# EAGLE schematic Proxmark3_dev (EAGLE 5.11)

## Sheet 1 of 4
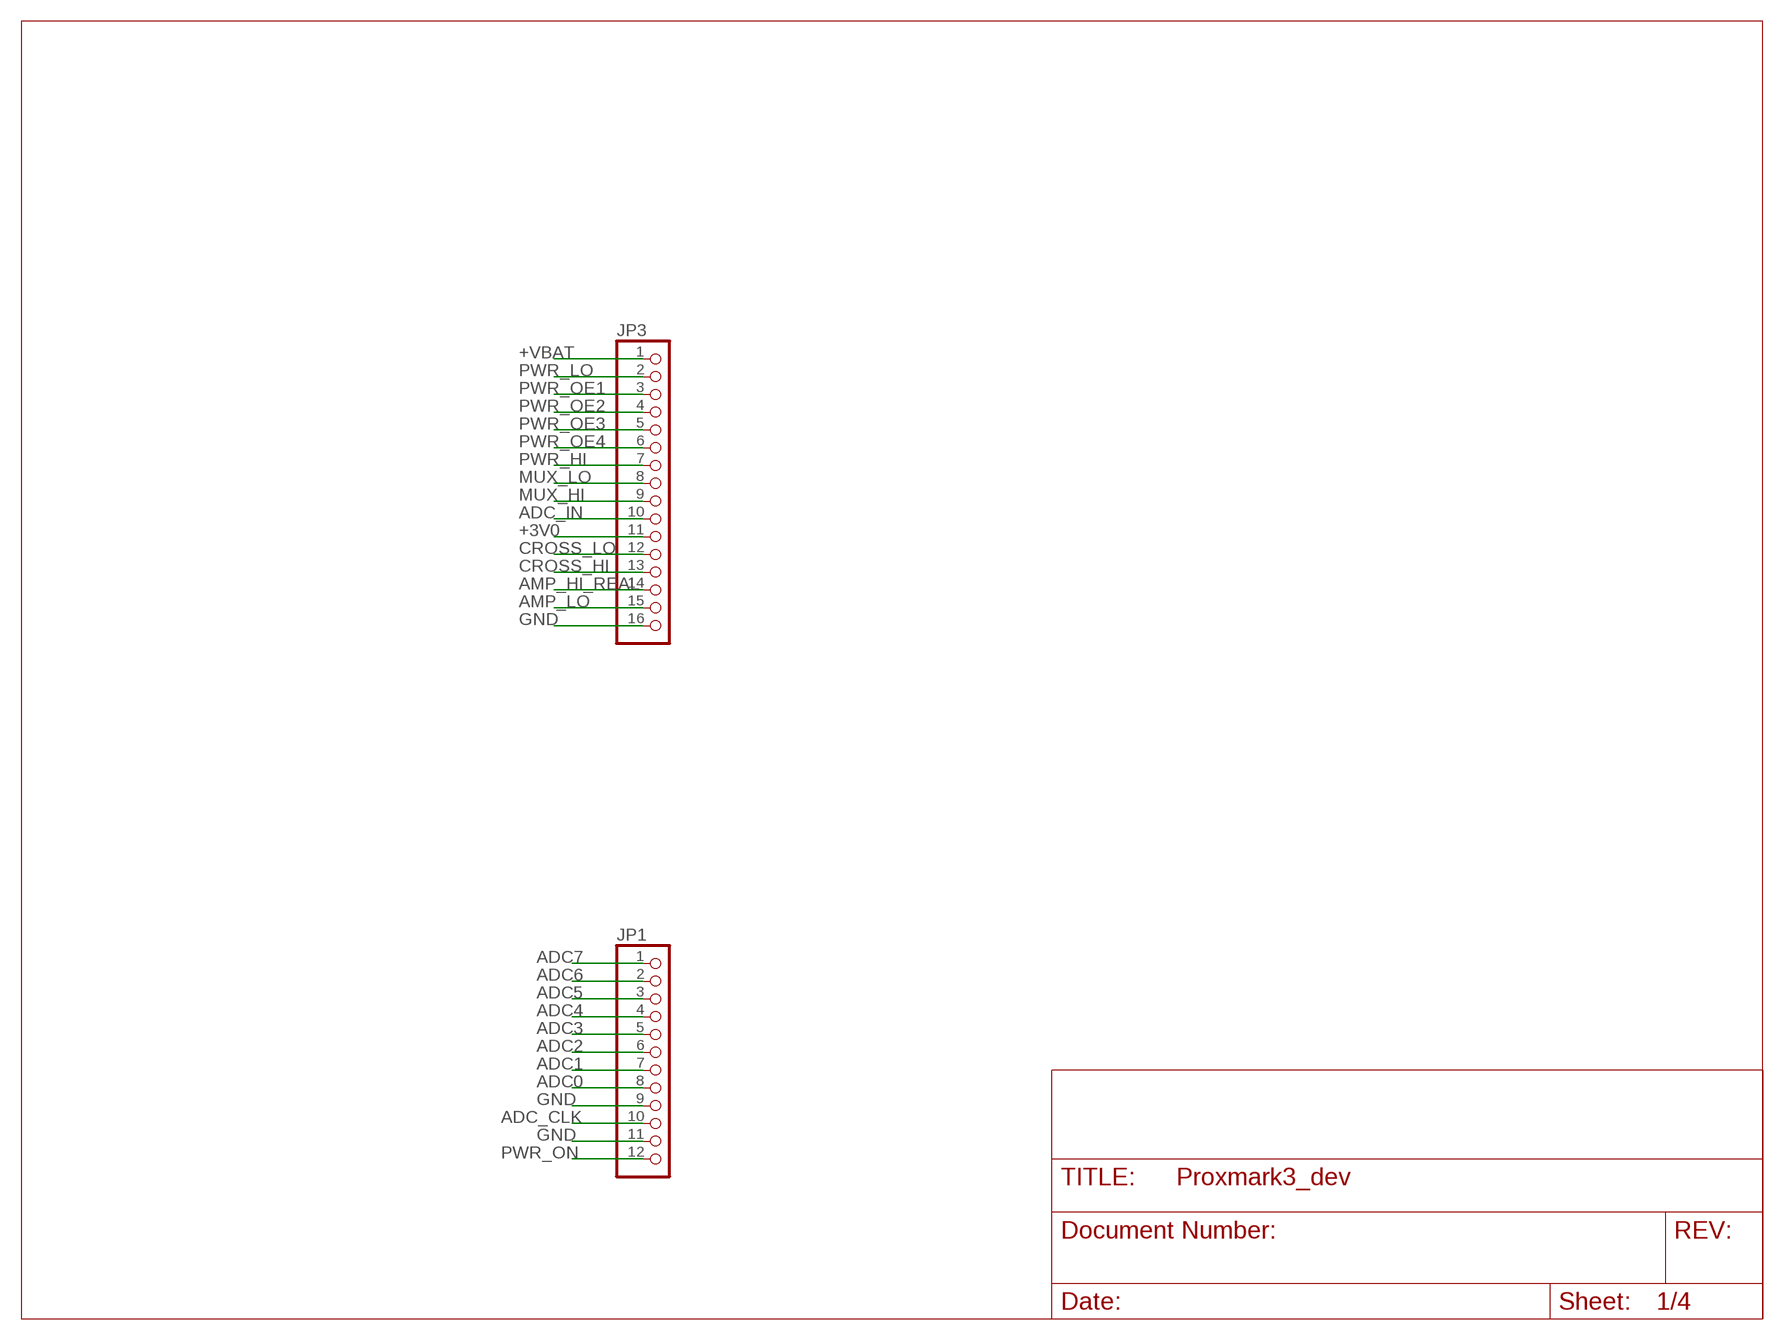
[diagram p0: schematic, sheet 1]

### Parts
JP1  PINHD-1X12  [1X12]
JP3  HEADER-1X16ROUND  [1X16_ROUND]

### Nets
+3V0: JP3.11 ; also sheet 2,3
+VBAT [power]: JP3.1 ; also sheet 2,4
ADC0: JP1.8 ; also sheet 2
ADC1: JP1.7 ; also sheet 2
ADC2: JP1.6 ; also sheet 2
ADC3: JP1.5 ; also sheet 2
ADC4: JP1.4 ; also sheet 2
ADC5: JP1.3 ; also sheet 2
ADC6: JP1.2 ; also sheet 2
ADC7: JP1.1 ; also sheet 2
ADC_CLK: JP1.10 ; also sheet 2
ADC_IN: JP3.10 ; also sheet 2,3
AMP_HI_REAL: JP3.14 ; also sheet 3
AMP_LO: JP3.15 ; also sheet 3
CROSS_HI: JP3.13 ; also sheet 2,3
CROSS_LO: JP3.12 ; also sheet 2,3
GND: JP1.9 JP1.11 JP3.16 ; also sheet 2,3,4
MUX_HI: JP3.9 ; also sheet 2,3
MUX_LO: JP3.8 ; also sheet 2,3
PWR_HI: JP3.7 ; also sheet 2,4
PWR_LO: JP3.2 ; also sheet 2,4
PWR_OE1: JP3.3 ; also sheet 2,4
PWR_OE2: JP3.4 ; also sheet 2,4
PWR_OE3: JP3.5 ; also sheet 2,4
PWR_OE4: JP3.6 ; also sheet 2,4
PWR_ON: JP1.12 ; also sheet 2

## Sheet 2 of 4
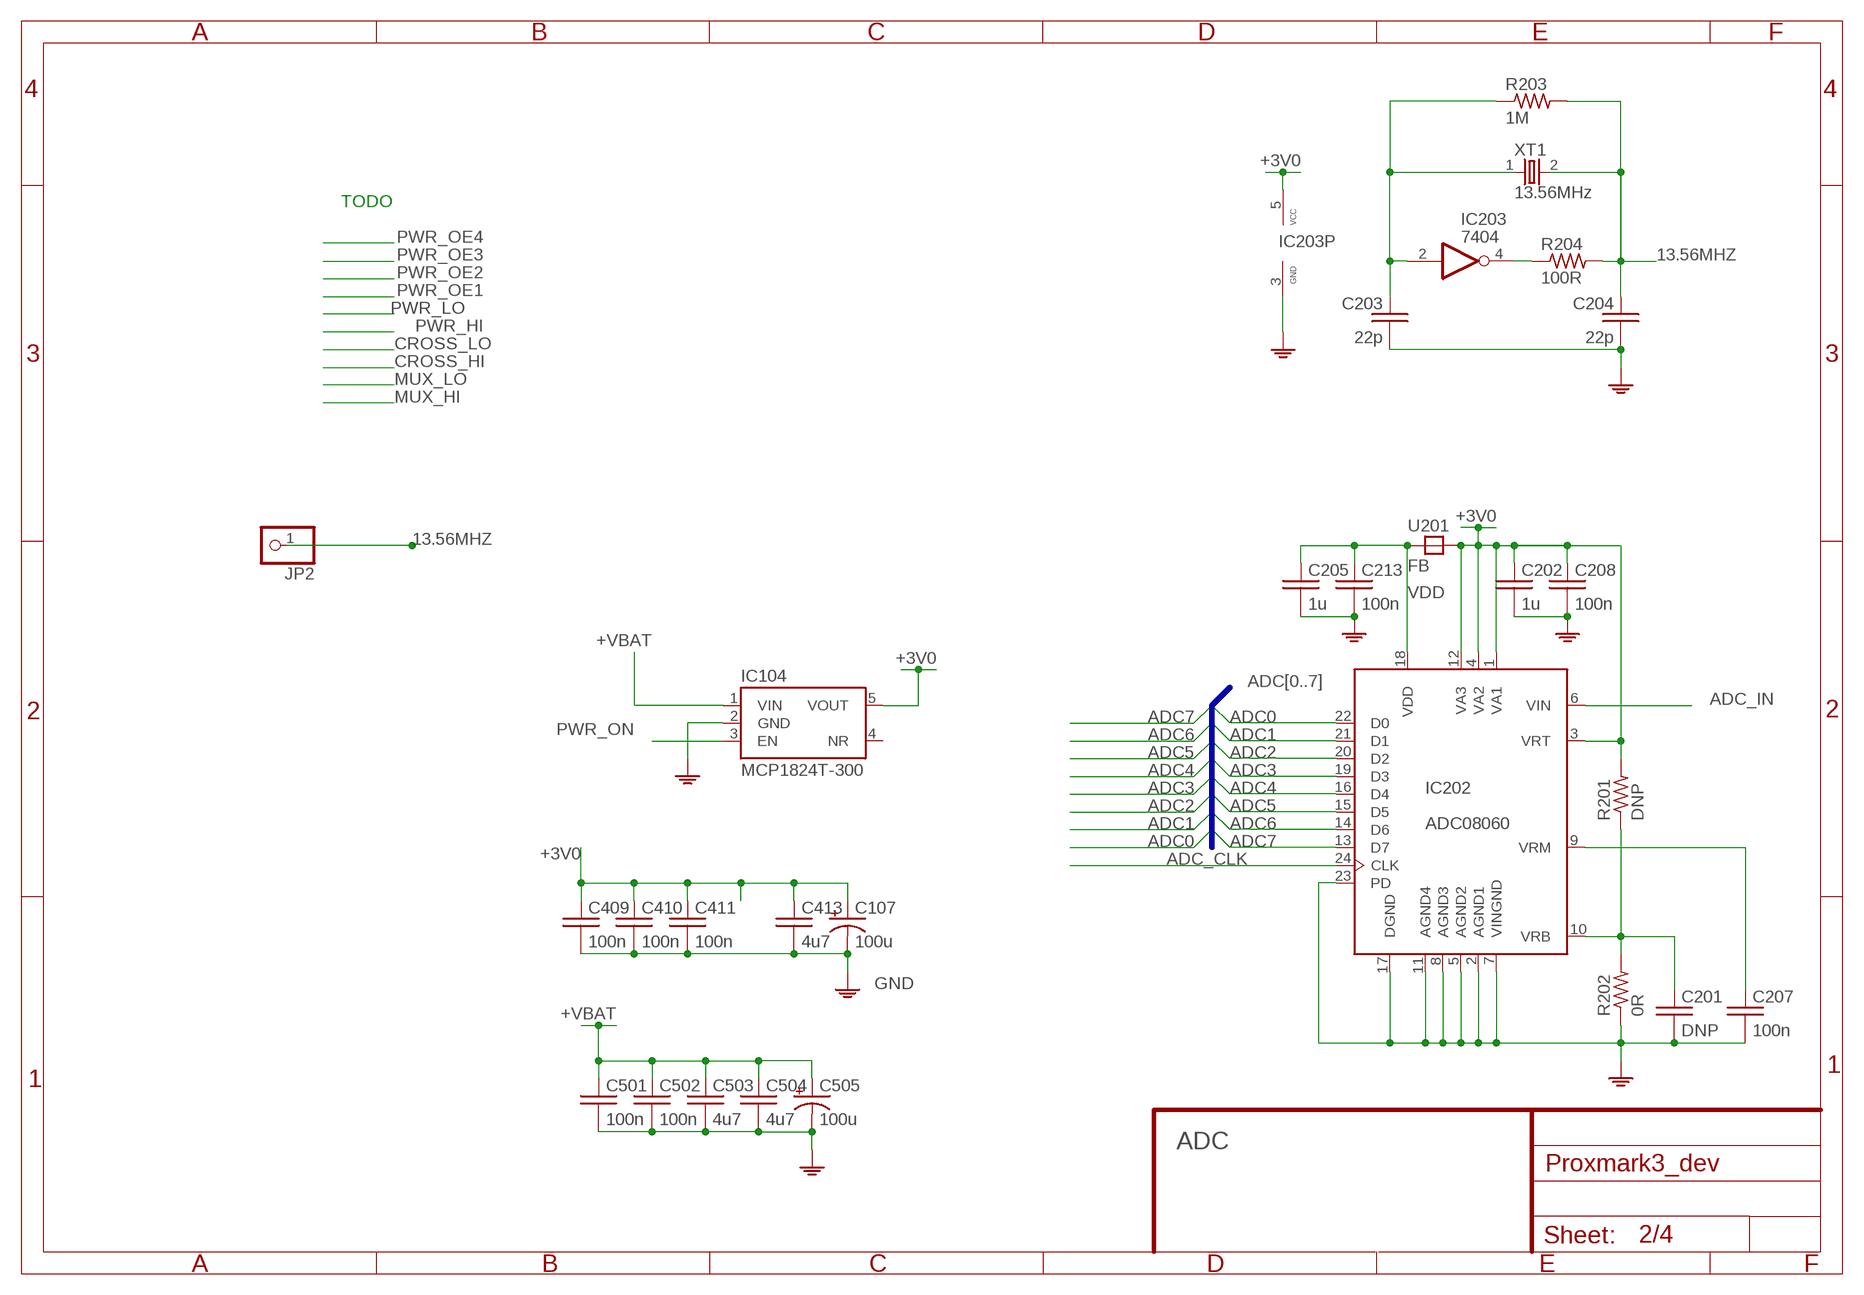
[diagram p1: schematic, sheet 2]

### Parts
C107  100u  CPOL-US  [153CLV-0605]
C201  DNP  C-EU  [0603]
C202  1u  C-EU  [0603]
C203  22p  C-EU  [0603]
C204  22p  C-EU  [0603]
C205  1u  C-EU  [0603]
C207  100n  C-EU  [0603]
C208  100n  C-EU  [0603]
C213  100n  C-EU  [0603]
C409  100n  C-EU  [0603]
C410  100n  C-EU  [0603]
C411  100n  C-EU  [0603]
C413  4u7  C-EU  [0603]
C501  100n  C-EU  [0603]
C502  100n  C-EU  [0603]
C503  4u7  C-EU  [0603]
C504  4u7  C-EU  [0603]
C505  100u  CPOL-US  [153CLV-0605]
IC104  MCP1824T-300  TPS79930  [SOT-23-5]
IC202  ADC08060  [TSSOP24]
IC203  7404  [SOT-23-5]
JP2  HEADER-1X1ROUND  [1X01_ROUND]
R201  DNP  R-US  [0603]
R202  0R  R-US  [0603]
R203  1M  R-US  [0603]
R204  100R  R-US  [0603]
U201  FB  [0805]
XT1  13.56MHz  XTAL  [6035]

### Nets
13.56MHZ: C204.1 JP2.1 R203.2 R204.2 XT1.2(G$2)
+3V0: C107.+ C202.1 C208.1 C409.1 C410.1 C411.1 C413.1 IC104.5(VOUT) IC202.1(VA1) IC202.3(VRT) IC202.4(VA2) IC202.12(VA3) IC203.5(VCC) R201.2 U201.2(B) ; also sheet 1,3
+VBAT [power]: C501.1 C502.1 C503.1 C504.1 C505.+ IC104.1(VIN) ; also sheet 1,4
ADC0: IC202.22(D0) ; also sheet 1
ADC1: IC202.21(D1) ; also sheet 1
ADC2: IC202.20(D2) ; also sheet 1
ADC3: IC202.19(D3) ; also sheet 1
ADC4: IC202.16(D4) ; also sheet 1
ADC5: IC202.15(D5) ; also sheet 1
ADC6: IC202.14(D6) ; also sheet 1
ADC7: IC202.13(D7) ; also sheet 1
ADC_CLK: IC202.24(CLK) ; also sheet 1
ADC_IN: IC202.6(VIN) ; also sheet 1,3
GND: C107.- C201.2 C202.2 C203.2 C204.2 C205.2 C207.2 C208.2 C213.2 C409.2 C410.2 C411.2 C413.2 C501.2 C502.2 C503.2 C504.2 C505.- IC104.2(GND) IC202.2(AGND1) IC202.5(AGND2) IC202.7(VINGND) IC202.8(AGND3) IC202.11(AGND4) IC202.17(DGND) IC202.23(PD) IC203.3(GND) R202.1 ; supply symbol labelled AGND ; also sheet 1,3,4
N$1: C207.1 IC202.9(VRM)
N$3: IC203.4(O) R204.1
N$4: C203.1 IC203.2(I) R203.1 XT1.1(G$1)
N$9: C201.1 IC202.10(VRB) R201.1 R202.2
PWR_ON: IC104.3(EN) ; also sheet 1
VDD: C205.1 C213.1 IC202.18(VDD) U201.1(A)
Unconnected: IC104.4(NR)

### Buses
ADC[0..7]

### Notes on the sheet
- TODO
- ADC

## Sheet 3 of 4
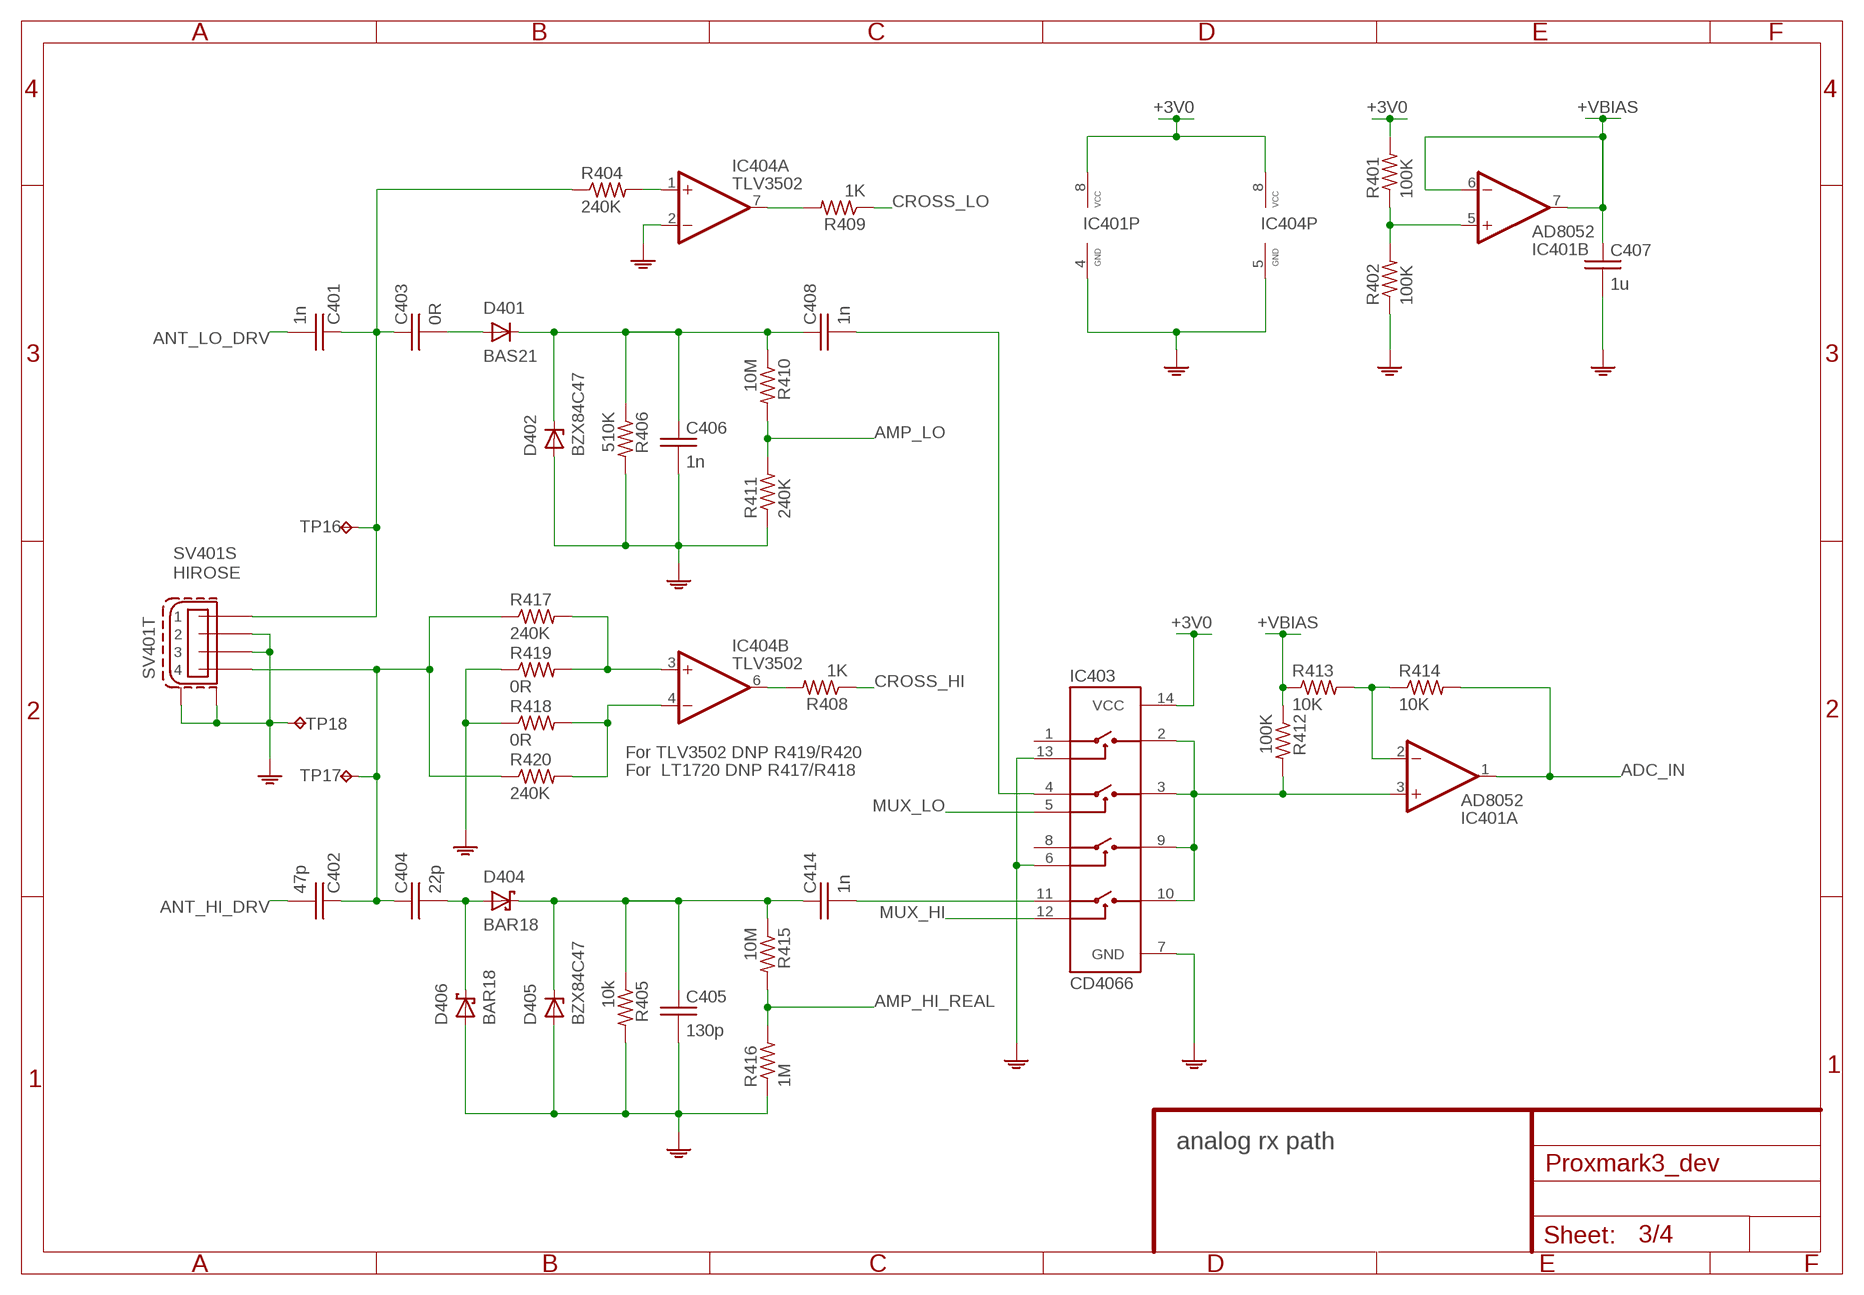
[diagram p2: schematic, sheet 3]

### Parts
C401  1n  C-EU  [0603]
C402  47p  C-EU  [0603]
C403  0R  C-EU  [0603]
C404  22p  C-EU  [0603]
C405  130p  C-EU  [0603]
C406  1n  C-EU  [0603]
C407  1u  C-EU  [0603]
C408  1n  C-EU  [0603]
C414  1n  C-EU  [0603]
D401  BAS21  [SOT-23-3]
D402  BZX84C47  [SOT-23-3]
D404  BAR18  [SOT-23-3]
D405  BZX84C47  [SOT-23-3]
D406  BAR18  [SOT-23-3]
IC401  AD8052  [MSOP8]
IC403  CD4066  [TSSOP14]
IC404  TLV3502  TLV3502SOT23-8  [SOT-23-8]
R401  100K  R-US  [0603]
R402  100K  R-US  [0603]
R404  240K  R-US  [0603]
R405  10k  R-US  [0603]
R406  510K  R-US  [0603]
R408  1K  R-US  [0603]
R409  1K  R-US  [0603]
R410  10M  R-US  [0603]
R411  240K  R-US  [0603]
R412  100K  R-US  [0603]
R413  10K  R-US  [0603]
R414  10K  R-US  [0603]
R415  10M  R-US  [0603]
R416  1M  R-US  [0603]
R417  240K  R-US  [0603]
R418  0R  R-US  [0603]
R419  0R  R-US  [0603]
R420  240K  R-US  [0603]
SV401  HIROSE  HIROSE-MQ172  [HIROSE-MQ172]
TP16  TPTP06SQ  [TP06SQ]
TP17  TPTP06SQ  [TP06SQ]
TP18  TPTP06SQ  [TP06SQ]

### Nets
+3V0: IC401.8(P:VCC) IC403.14(VCC) IC404.8(P:VCC) R401.2 ; also sheet 1,2
+VBIAS: C407.1 IC401.6(B:-IN) IC401.7(B:OUT) R412.1 R413.1
ADC_IN: IC401.1(A:OUT) R414.2 ; also sheet 1,2
ADCDR_HI: C405.1 C414.1 D404.3(C) D405.3(C) R405.1 R415.1
ADCDR_LO: C406.1 C408.1 D401.3(C) D402.3(C) R406.1 R410.1
AMP_HI_REAL: R415.2 R416.2 ; also sheet 1
AMP_LO: R410.2 R411.2 ; also sheet 1
ANT_HI_DRV: C402.2 ; also sheet 4
ANT_LO_DRV: C401.2 ; also sheet 4
CROSS_HI: R408.1 ; also sheet 1,2
CROSS_LO: R409.1 ; also sheet 1,2
GND: C405.2 C406.2 C407.2 D402.1(A) D405.1(A) D406.1(A) IC401.4(P:GND) IC403.6(C3) IC403.7(GND) IC403.13(C1) IC404.2(A:-IN) IC404.5(P:GND) R402.1 R405.2 R406.2 R411.1 R416.1 R418.1 R419.1 SV401.2 SV401.3 SV401.M1(T:S1) SV401.M2(T:S2) TP18.TP ; supply symbol labelled AGND ; also sheet 1,2,4
MUX_HI: IC403.12(C4) ; also sheet 1,2
MUX_LO: IC403.5(C2) ; also sheet 1,2
N$14: IC401.5(B:+IN) R401.1 R402.2
N$16: C414.2 IC403.11(A4)
N$17: C401.1 C403.1 R404.1 SV401.1 TP16.TP
N$20: C404.2 D404.1(A) D406.3(C)
N$23: IC404.1(A:+IN) R404.2
N$24: IC404.7(A:OUT) R409.2
N$25: IC401.3(A:+IN) IC403.2(B1) IC403.3(B2) IC403.9(B3) IC403.10(B4) R412.2
N$28: IC404.6(B:OUT) R408.2
N$29: IC404.3(B:+IN) R417.2 R419.2
N$30: C403.2 D401.1(A)
N$32: C408.2 IC403.4(A2)
N$40: IC404.4(B:-IN) R418.2 R420.2
N$43: C402.1 C404.1 R417.1 R420.1 SV401.4 TP17.TP
N$52: IC401.2(A:-IN) R413.2 R414.1
Unconnected: IC403.1(A1) IC403.8(A3)

### Notes on the sheet
- For TLV3502 DNP R419/R420
- For  LT1720 DNP R417/R418
- analog rx path

## Sheet 4 of 4
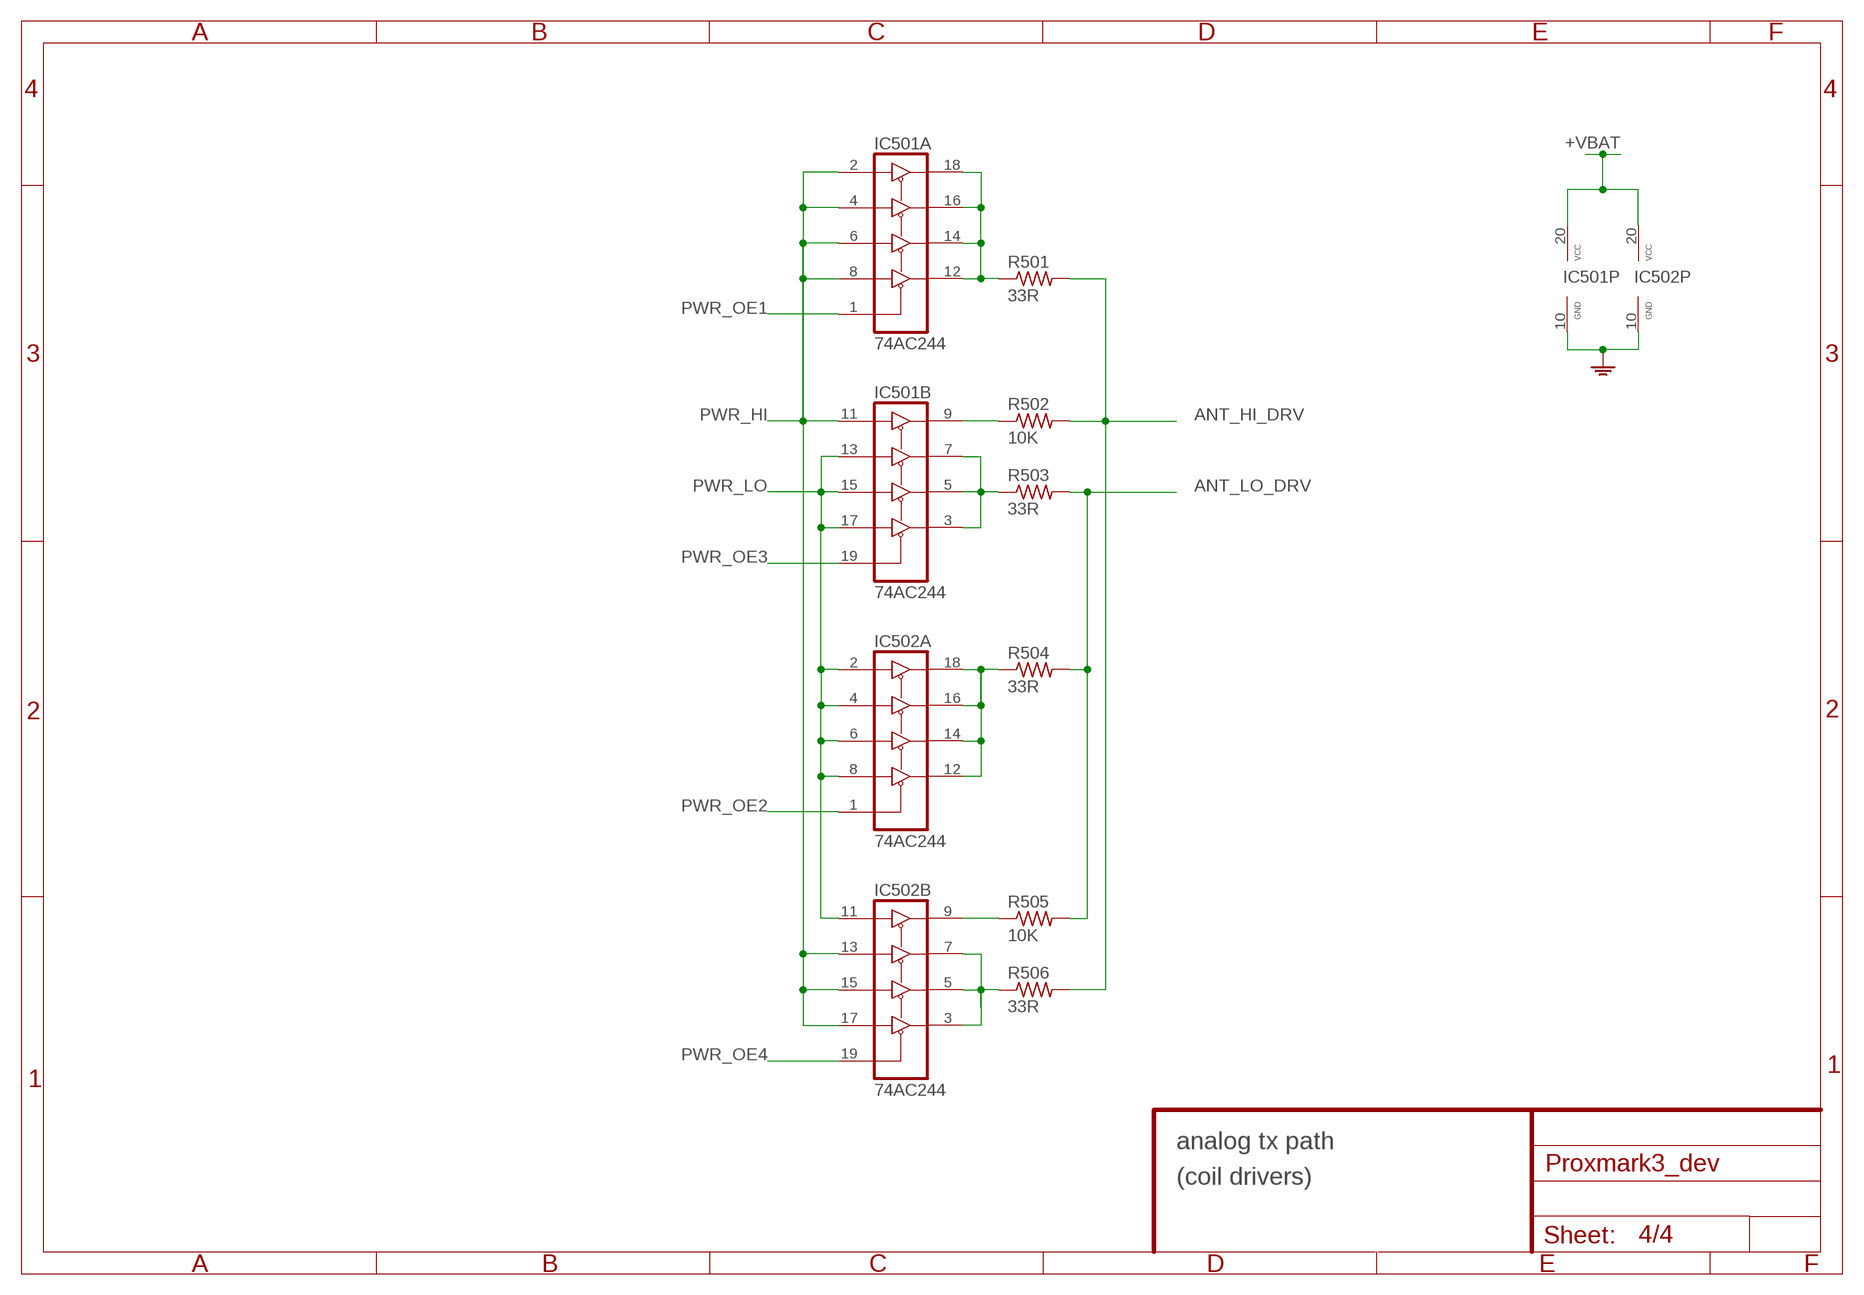
[diagram p3: schematic, sheet 4]

### Parts
IC501  74AC244  [TSSOP20]
IC502  74AC244  [TSSOP20]
R501  33R  R-US  [0603]
R502  10K  R-US  [0603]
R503  33R  R-US  [0603]
R504  33R  R-US  [0603]
R505  10K  R-US  [0603]
R506  33R  R-US  [0603]

### Nets
+VBAT [power]: IC501.20(P:VCC) IC502.20(P:VCC) ; also sheet 1,2
ANT_HI_DRV: R501.2 R502.2 R506.2 ; also sheet 3
ANT_LO_DRV: R503.2 R504.2 R505.2 ; also sheet 3
GND: IC501.10(P:GND) IC502.10(P:GND) ; supply symbol labelled AGND ; also sheet 1,2,3
N$33: IC501.12(A:Y4) IC501.14(A:Y3) IC501.16(A:Y2) IC501.18(A:Y1) R501.1
N$34: IC502.12(A:Y4) IC502.14(A:Y3) IC502.16(A:Y2) IC502.18(A:Y1) R504.1
N$41: IC501.3(B:Y4) IC501.5(B:Y3) IC501.7(B:Y2) R503.1
N$42: IC502.3(B:Y4) IC502.5(B:Y3) IC502.7(B:Y2) R506.1
N$44: IC501.9(B:Y1) R502.1
N$45: IC502.9(B:Y1) R505.1
PWR_HI: IC501.2(A:A1) IC501.4(A:A2) IC501.6(A:A3) IC501.8(A:A4) IC501.11(B:A1) IC502.13(B:A2) IC502.15(B:A3) IC502.17(B:A4) ; also sheet 1,2
PWR_LO: IC501.13(B:A2) IC501.15(B:A3) IC501.17(B:A4) IC502.2(A:A1) IC502.4(A:A2) IC502.6(A:A3) IC502.8(A:A4) IC502.11(B:A1) ; also sheet 1,2
PWR_OE1: IC501.1(A:G) ; also sheet 1,2
PWR_OE2: IC502.1(A:G) ; also sheet 1,2
PWR_OE3: IC501.19(B:G) ; also sheet 1,2
PWR_OE4: IC502.19(B:G) ; also sheet 1,2

### Notes on the sheet
- analog tx path
- (coil drivers)

## Library data of the parts
C107 C505 = proxmark:CPOL-US: POLARIZED ELECTROLYTIC CAPACITOR
C201-C205 C207 C208 C213 C401-C411 C413 C414 C501-C504 = proxmark:C-EU: CERAMIC CHIP CAPACITOR
D401 = proxmark:BAS21: BAS21 fast switching diode Digikey part: BAS21INCT-ND
D402 D405 = proxmark:BZX84C*: ZENNER CHIP DIODE Digikey part: BZX84C47LT1GOSCT-ND
D404 D406 = proxmark:BAR18: SMALL SIGNAL SCHOTTKY DIODE Digikey part: 497-2529-1-ND
IC104 = proxmark:TPS799*: IC LDO REG 200mA Digikey part: 296-17782-1-ND
IC202 = proxmark:ADC08060: 8BIT A/D CONVERTER, 60MHZ Digikey part: ADC08060CIMTXCT-ND
IC203 = proxmark:74*04: Single CMOS inverter gate Digikey part: TC7SU04FFCT-ND
IC401 = proxmark:AD8052: Rail-to-rail Op-Amp Digikey part: AD8052ARMZ-ND
IC403 = proxmark:CD4066: 4-CH MUX 1.8/5.5V Digikey part: 296-14123-1-ND
IC404 = proxmark:TLV3502
IC501 IC502 = proxmark:74*244: Octal BUFFER and LINE DRIVER 3-state
JP1 = adafruit:PINHD-1X12: PIN HEADER
JP2 = microbuilder:HEADER-1X1: PIN HEADER
JP3 = microbuilder:HEADER-1X16: PIN HEADER
R201-R204 R401 R402 R404-R406 R408-R420 R501-R506 = proxmark:R-US: CHIP RESISTOR
SV401 = proxmark:HIROSE-MQ172: HIROSE MQ172 Connector Digikey part: H10488-ND
TP16-TP18 = proxmark:TP: Test pad
U201 = proxmark:FB: FERRITE BEAD
XT1 = proxmark:XTAL: CRYSTAL Citizen CS10 series 6.0mm x 3.5mm package

## Net classes
1 power: width 0.305 mm